# Altium schematic sheet 接收端V02.SchDoc
size A3
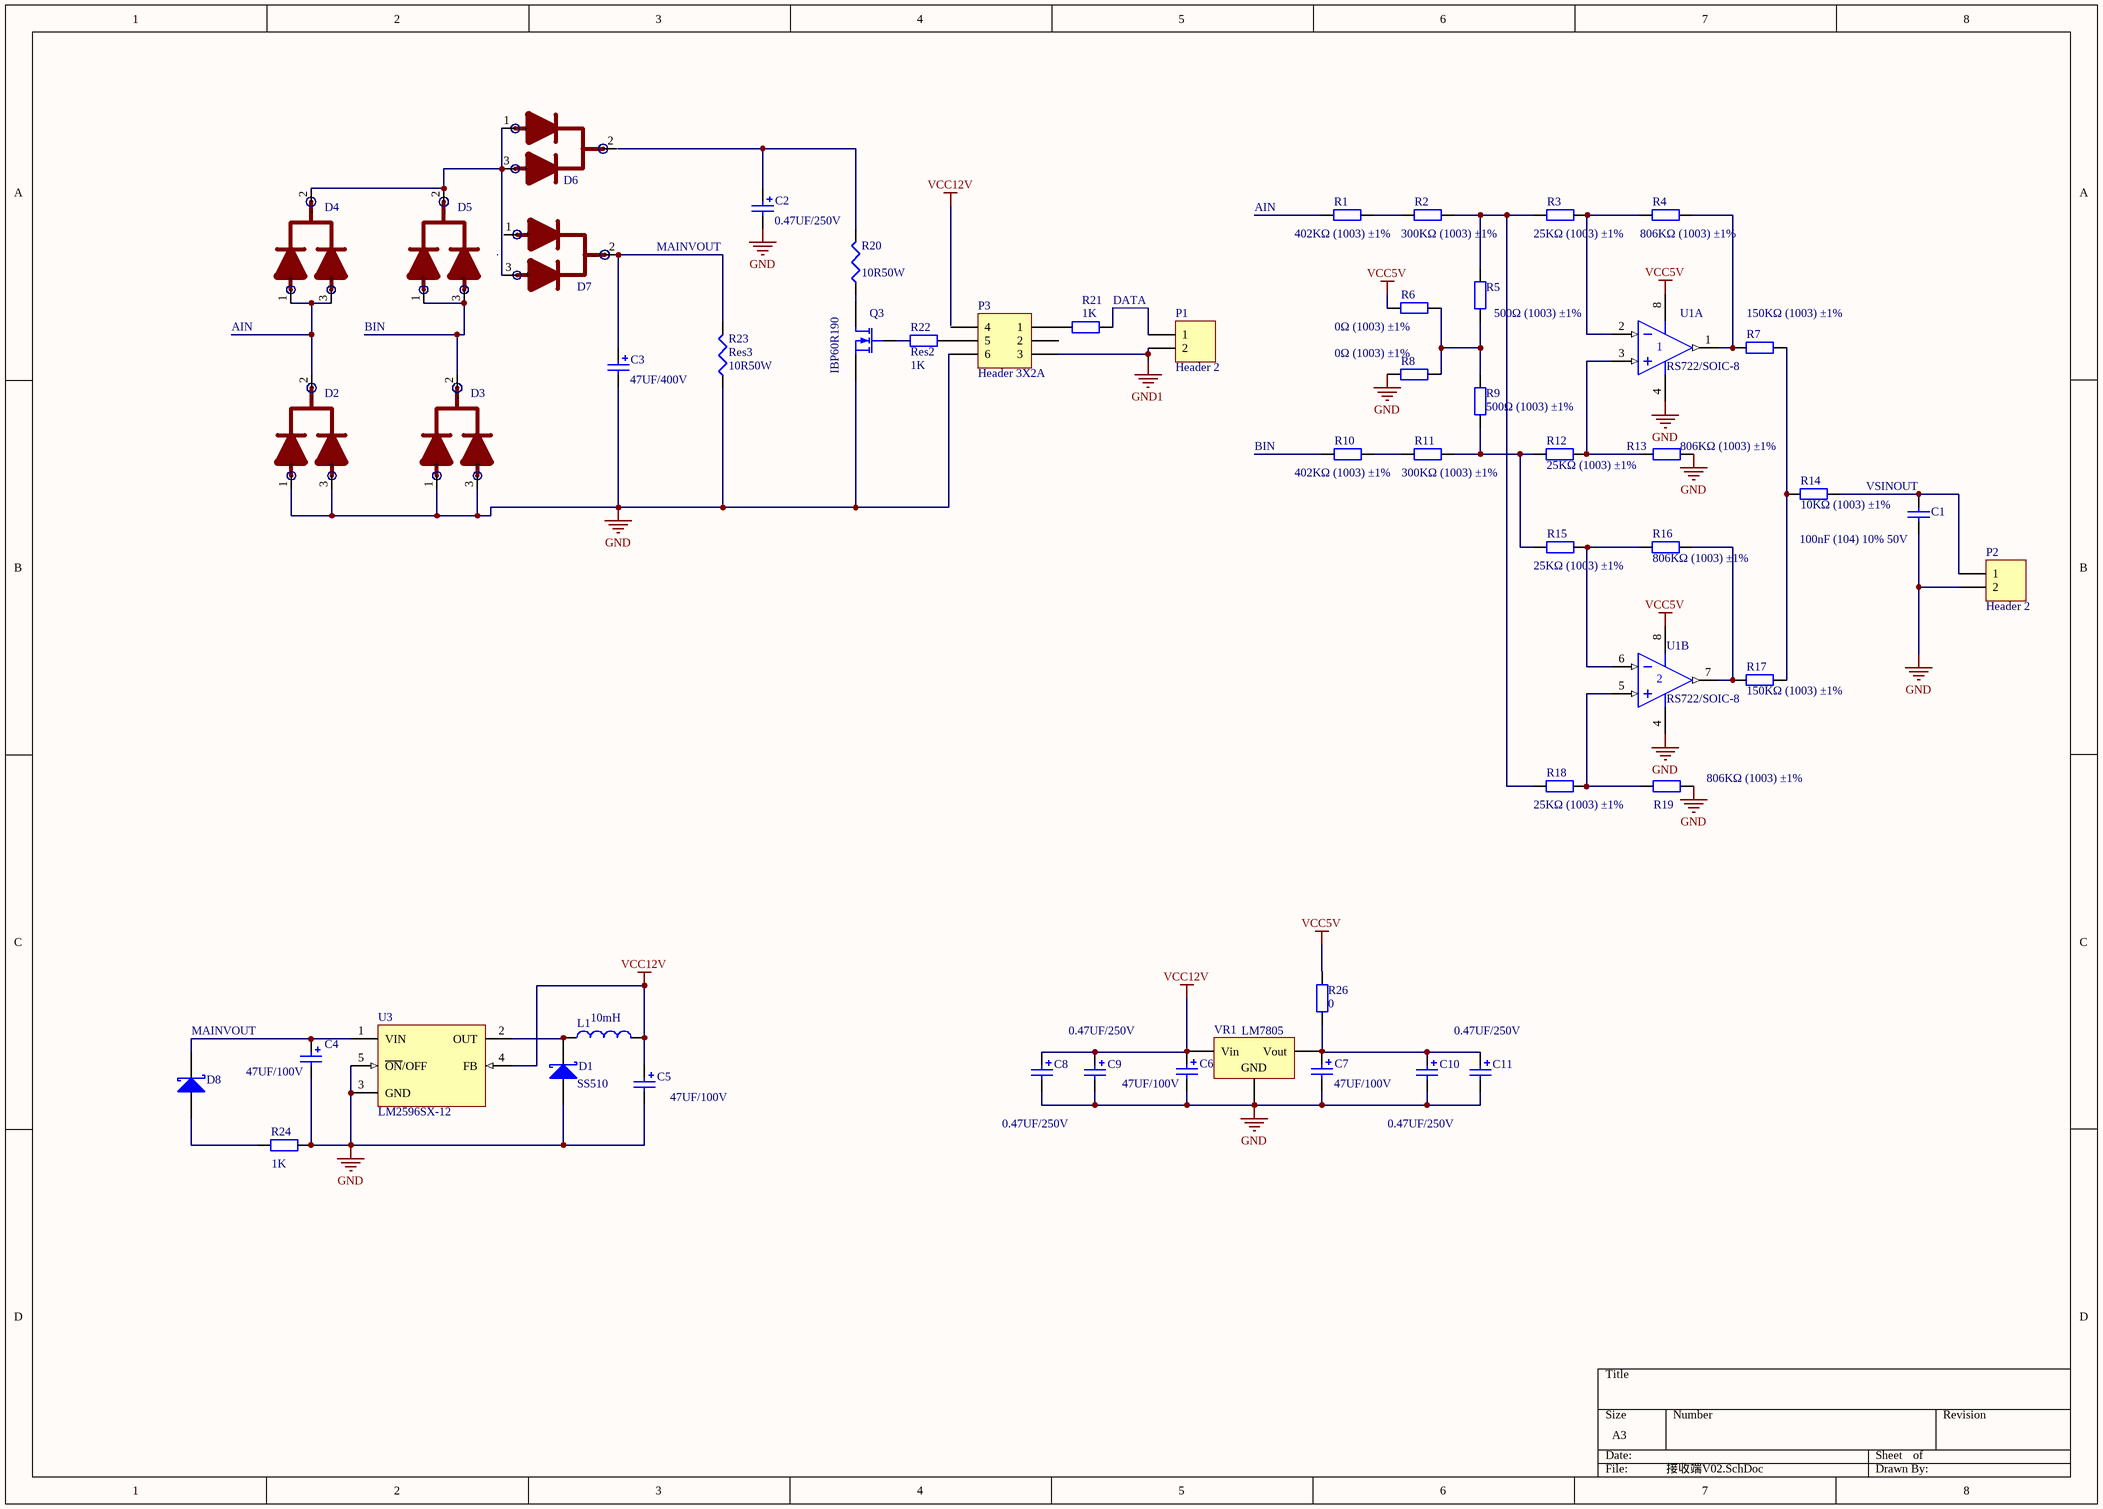
[diagram p0: 接收端V02.SchDoc]

## Parts
C1  100nF (104) 10% 50V  [1206_C]
C2  value 0.47UF/250V  [电解电容直插]  (hidden comment: Cap Pol2)
C3  value 47UF/400V  [C1020]  (hidden comment: Cap Pol2)
C4  value 47UF/100V  [C1020]  (hidden comment: Cap Pol2)
C5  value 47UF/100V  [C1020]  (hidden comment: Cap Pol2)
C6  value 47UF/100V  [C1020]  (hidden comment: Cap Pol2)
C7  value 47UF/100V  [C1020]  (hidden comment: Cap Pol2)
C8  value 0.47UF/250V  [1206_C]  (hidden comment: Cap Pol2)
C9  value 0.47UF/250V  [电解电容直插]  (hidden comment: Cap Pol2)
C10  value 0.47UF/250V  [电解电容直插]  (hidden comment: Cap Pol2)
C11  value 0.47UF/250V  [1206_C]  (hidden comment: Cap Pol2)
D1  SS510  [SMC(DO-214AB)_S1]
D2  肖特基二极管  [TO-220(带散热片)]  (value not drawn)
D3  肖特基二极管  [TO-220(带散热片)]  (value not drawn)
D4  肖特基二极管  [TO-220(带散热片)]  (value not drawn)
D5  肖特基二极管  [TO-220(带散热片)]  (value not drawn)
D6  肖特基二极管  [TO-220(带散热片)]  (value not drawn)
D7  肖特基二极管  [TO-220(带散热片)]  (value not drawn)
D8  D Schottky  [SMC(DO-214AB)_S1]  (value not drawn)
L1  value 10mH  [H4.7UH]  (hidden comment: Inductor)
P1  Header 2  [HDR1X2]
P2  Header 2  [HDR1X2]
P3  Header 3X2A  [SOIC_6]
Q3  IBP60R190  [TO-220(带散热片)]
R1  402KΩ (1003) ±1%  [1206_R]
R2  300KΩ (1003) ±1%  [1206_R]
R3  25KΩ (1003) ±1%  [1206_R]
R4  806KΩ (1003) ±1%  [1206_R]
R5  500Ω (1003) ±1%  [1206_R]
R6  0Ω (1003) ±1%  [1206_R]
R7  150KΩ (1003) ±1%  [1206_R]
R8  0Ω (1003) ±1%  [1206_R]
R9  500Ω (1003) ±1%  [1206_R]
R10  402KΩ (1003) ±1%  [1206_R]
R11  300KΩ (1003) ±1%  [1206_R]
R12  25KΩ (1003) ±1%  [1206_R]
R13  806KΩ (1003) ±1%  [1206_R]
R14  10KΩ (1003) ±1%  [1206_R]
R15  25KΩ (1003) ±1%  [1206_R]
R16  806KΩ (1003) ±1%  [1206_R]
R17  150KΩ (1003) ±1%  [1206_R]
R18  25KΩ (1003) ±1%  [1206_R]
R19  806KΩ (1003) ±1%  [1206_R]
R20  value 10R50W  [1206_R]  (hidden comment: Res3)
R21  value 1K  [1206_R]  (hidden comment: Res2)
R22  Res2  value 1K  [1206_R]
R23  Res3  value 10R50W  [1206_R]
R24  value 1K  [1206_R]  (hidden comment: Res2)
R26  0  [1206_R]
U1  RS722/SOIC-8  [SOIC-8_150mil]  (parts A,B of 2)
U3  LM2596SX-12  [TO-263-5]
VR1  LM7805  [D2PAK_N]

## Nets
GND: C1.1 C2.2 C3.2 C4.2 C5.2 C6.2 C7.2 C8.2 C9.2 C10.2 C11.2 D1.1(A) D2.1(+) D2.3(+) D3.1(+) D3.3(+) P2.2 P3.6 Q3.3(S) R8.1 R13.2 R19.2 R23.1 R24.2 U1.4(V-) U3.3(GND) U3.5(~{ON}/OFF) VR1.2(GND)
GND1: P1.2 P3.3
VCC5V: R6.1 R26.2 U1.8(V+)
VCC12V: C5.1 C6.1 C8.1 C9.1 L1.2 U3.4(FB) VR1.1(Vin)
AIN: D2.2(-) D4.1(+) D4.3(+) R1.1
BIN: D3.2(-) D5.1(+) D5.3(+) R10.1
DATA: P1.1 R21.2
MAINVOUT: C3.1 C4.1 D7.2(-) D8.2(K) R23.2 U3.1(VIN)
VSINOUT: C1.2 P2.1 R14.2
NetC2_1: C2.1 R20.2
NetC7_1: C7.1 C10.1 C11.1 R26.1 VR1.3(Vout)
NetD1_2: D1.2(K) L1.1 U3.2(OUT)
NetD4_2: D4.2(-) D5.2(-) D6.1(+) D6.3(+) D7.3(+)
NetD8_1: D8.1(A) R24.1
NetP3_1: P3.1 R21.1
NetP3_5: P3.5 R22.2
NetQ3_1: Q3.1(G) R22.1
NetQ3_2: Q3.2(D) R20.1
NetR1_2: R1.2 R2.1
NetR2_2: R2.2 R3.1 R5.2 R18.1
NetR3_2: R3.2 R4.1 U1.2(IN-)
NetR4_2: R4.2 R7.1 U1.1(OUT)
NetR5_1: R5.1 R6.2 R8.2 R9.2
NetR7_2: R7.2 R14.1 R17.2
NetR9_1: R9.1 R11.2 R12.1 R15.1
NetR10_2: R10.2 R11.1
NetR12_2: R12.2 R13.1 U1.3(IN+)
NetR15_2: R15.2 R16.1 U1.6(IN-)
NetR16_2: R16.2 R17.1 U1.7(OUT)
NetR18_2: R18.2 R19.1 U1.5(IN+)

Not connected (* = marked no-connect by the designer): D6 2(-); D7 1(+); P3 2 4

## Library data of the parts
C1 = 1206 100nF (104) 10% 50V: 贴片电容; ComponentLink1Description: 供应商链接; ComponentLink1URL: http://www.szlcsc.com/product/details_25237.html; Package: 1206; Supplier: LC; SuppliersPartNumber: C24497
C2-C11 = Cap Pol2: Polarized Capacitor (Axial); Published: 8-Jun-2000; LatestRevisionDate: 17-Jul-2002; LatestRevisionNote: Re-released for DXP Platform.; PackageReference: POLAR0.8; Publisher: Altium Limited; PackageDescription: Polarized Capacitor; 2 Leads
D1 D8 = D Schottky: Schottky Diode; Published: 8-Jun-2000; LatestRevisionDate: 17-Jul-2002; LatestRevisionNote: Re-released for DXP Platform.; PackageReference: SMB; Publisher: Altium Limited; PackageDescription: DO-214-AA/SMB; 2 C-Bend Leads; Body 5.3 x 3.6 mm, inc. leads (LxW); Code_JEDEC: DO-214-AA
L1 = Inductor: Code_IEC: 1005; Published: 8-Jun-2000; LatestRevisionDate: 29-May-2009; LatestRevisionNote: IPC-7351 Footprint Added.; PackageReference: 0402-A; Publisher: Altium Limited; PackageDescription: Chip Inductor; Code_JEITA: 0402
P1 P2 = Header 2: Header, 2-Pin; LatestRevisionDate: 17-Jul-2002; LatestRevisionNote: Re-released for DXP Platform.; Publisher: Altium Limited
P3 = Header 3X2A: Header, 3-Pin, Dual row; LatestRevisionDate: 17-Jul-2002; LatestRevisionNote: Re-released for DXP Platform.; Publisher: Altium Limited
Q3 = MOSFET-N: N-Channel MOSFET; Published: 8-Jun-2000; LatestRevisionDate: 17-Jul-2002; LatestRevisionNote: Re-released for DXP Platform.; PackageVersion: 1995/1996; PackageReference: E3; Publisher: Altium Limited; PackageDescription: TO, Flat Index; 3 In-Line, Axial Leads; Body Dia. 4.6mm; Lead Dia. 0.5 mm (max)
R1-R19 R26 = 1206 100KΩ (1003) 1%: 贴片电阻; ComponentLink1Description: 供应商链接; ComponentLink1URL: http://www.szlcsc.com/product/details_18588.html; Package: 1206; Supplier: LC; SuppliersPartNumber: C17900
R20 R23 = Res3: Resistor; Published: 8-Jun-2000; LatestRevisionDate: 29-May-2009; LatestRevisionNote: IPC-7351 Footprint Added.; PackageReference: J1-0603; Publisher: Altium Limited; PackageDescription: Chip Resistor
R21 R22 R24 = Res2: Resistor; Published: 8-Jun-2000; LatestRevisionDate: 17-Jul-2002; LatestRevisionNote: Re-released for DXP Platform.; PackageReference: AXIAL-0.4; Publisher: Altium Limited; PackageDescription: Axial Device, Thru-Hole; 2 Leads; 0.4 in Pin Spacing
U1 = NE5532DR_[C7426]: 功放; ComponentLink1Description: 供应商链接; ComponentLink1URL: http://www.szlcsc.com/product/details_7903.html; Package: SOIC-8_150mil; Supplier: LC; SuppliersPartNumber: C7426
U3 = LM2596SX-5.0/NOPB_[C10002]: DC-DC芯片; ComponentLink1Description: 供应商链接; ComponentLink1URL: http://www.szlcsc.com/product/details_10538.html; Package: TO-263-5; Supplier: LC; SuppliersPartNumber: C10002
VR1 = Volt Reg: Voltage Regulator; Published: 24-Mar-1999; LatestRevisionDate: 29-May-2009; LatestRevisionNote: IPC-7351 Footprint Added.; PackageReference: D2PAK; Publisher: Altium Limited; PackageDescription: 3-Pin Transistor Outline Package 2.54 mm Pitch, 15.1 mm Lead Span